# Altium project ir-tara-smd.PrjPcb
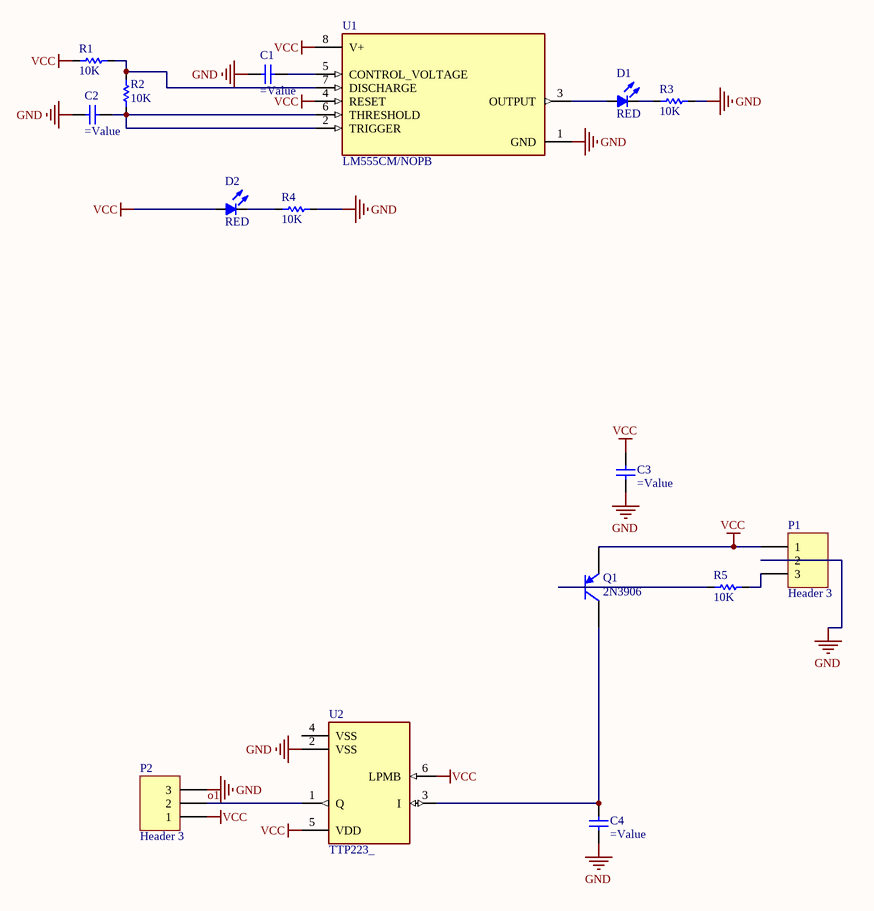
[diagram p0: ir-tara-smd-ttp223.SchDoc]
1 sheet, 16 parts. Net scope: global (net labels, ports and power ports of the same name join across sheets).
Board file: ir-tara-smd.PcbDoc

## Sheet ir-tara-smd-ttp223.SchDoc
size A3

### Parts
C1  (no value)  [CAP 0805]
C2  (no value)  [CAP 0805]
C3  (no value)  [CAP 0805]
C4  (no value)  [CAP 1206]
D1  COLOR: RED  [LED-5mm]  (hidden comment: MODEL)
D2  COLOR: RED  [LED-5mm]  (hidden comment: MODEL)
P1  Header 3  [HDR1X3]
P2  Header 3  [HDR1X3]
Q1  2N3906  [SOT23-3]
R1  10K  [RES 0805 (2012X06L)]
R2  10K  [RES 0805 (2012X06L)]
R3  10K  [RES 0805 (2012X06L)]
R4  10K  [RES 1206 (3216X08L)]
R5  10K  [RES 0805 (2012X06L)]
U1  LM555CM/NOPB  [SOIC127P599X175-8N]
U2  TTP223_  [SOT95P285X126-6N]

### Nets
GND: C1.2(-) C2.2(-) C3.2(-) C4.2(-) P1.2 P2.3 R3.2 R4.2 U1.1(GND) U2.2(VSS)
VCC: C3.1(+) D2.1(A) P1.1 P2.1 Q1.1(E) R1.2 U1.4(RESET) U1.8(V+) U2.5(VDD) U2.6(LPMB)
o1: P2.2 U2.1(Q)
NetC1_1: C1.1(+) U1.5(CONTROL_VOLTAGE)
NetC2_1: C2.1(+) R2.1 U1.2(TRIGGER) U1.6(THRESHOLD)
NetC4_1: C4.1(+) Q1.3(C) U2.3(I)
NetD1_1: D1.1(A) U1.3(OUTPUT)
NetD1_2: D1.2(K) R3.1
NetD2_2: D2.2(K) R4.1
NetP1_3: P1.3 R5.1
NetQ1_2: Q1.2(B) R5.2
NetR1_1: R1.1 R2.2 U1.7(DISCHARGE)

Not connected (* = marked no-connect by the designer): U2 4(VSS)

### Library data of the parts
C1-C4 = Capacitor
D1 D2 = LED 5mm: Typical LED
P1 P2 = Header 3: Header, 3-Pin; LatestRevisionDate: 17-Jul-2002; LatestRevisionNote: Re-released for DXP Platform.; Publisher: Altium Limited
Q1 = 2N3906: PNP General Purpose Amplifier; pin to pad: 1>2 2>1; Published: 8-Jun-2000; LatestRevisionDate: 15-Jan-2003; LatestRevisionNote: PCB Footprint 'BCY-W3/D4.7' replaced; DatasheetVersion: 1997; PackageVersion: Sep-1998; PackageReference: TO-92A; Publisher: Altium Limited; PackageDescription: TO, Flat Index; 3 In-Line, Axial Leads; Body Dia. 4.5mm; Leads 0.51 x 0.48 mm (max); ComponentLink1Description: Manufacturer Link; ComponentLink1URL: http://www.fairchildsemi.com/; ComponentLink2Description: Datasheet; ComponentLink2URL: http://www.fairchildsemi.com/ds/2N%2F2N3906.pdf
R1-R5 = Resistor: Tolerance: 5%; Power: 1/4 W; Value: 10K
U1 = LM555CM/NOPB: Highly Stable 555 Timer 8-SOIC 0 to 70; Price: None; MP: LM555CM/NOPB; Availability: Unavailable; Value: *; Package: None
U2 = TTP223_: 22 kOhms Â±5% 0.1W, 1/10W Chip Resistor 0402 _1005 Metric_ Automotive AEC-Q200, Moisture Resistant Thick Film; MP: TTP223; MF: KOA Speer; Price: None; SnapEDA_Link: https://www.snapeda.com/parts/TTP223%20/KOA%20Speer/view-part/2780209/?ref=snap; Package: 0402 KOA Speer; Availability: Unavailable; Value: *